# EAGLE design Board_PIC28 (EAGLE 7.6.0)
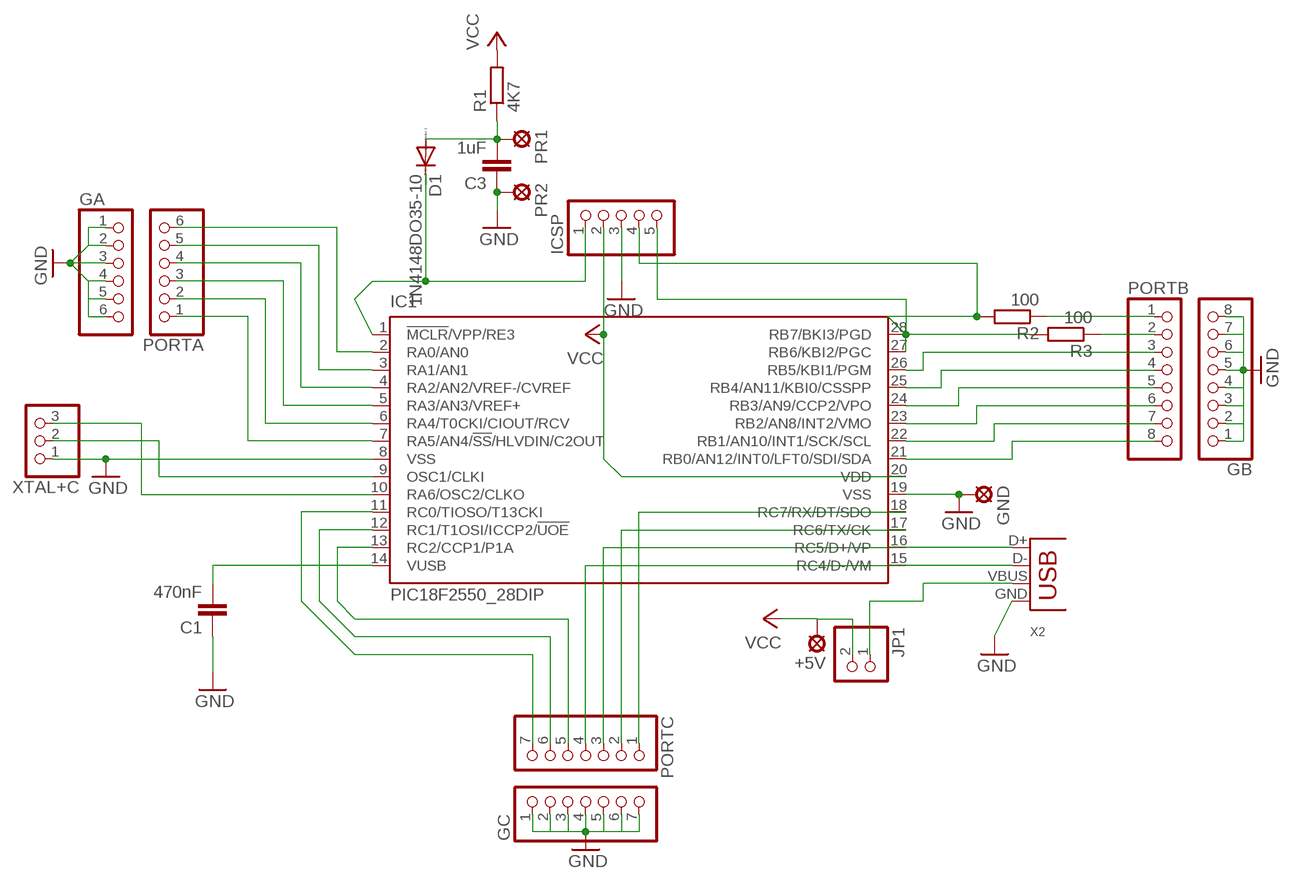
[diagram p0: schematic, sheet 1]

## Parts
+5V  LSP10  [LSP10]
C1  470nF  C5/3.5  [C5B3.5]
C3  1uF  C5/3.5  [C5B3.5]
D1  1N4148DO35-10  [DO35-10]
GA  PINHD-1X6  [1X06]
GB  PINHD-1X8  [1X08]
GC  PINHD-1X7  [1X07]
GND  LSP10  [LSP10]
IC1  PIC18F2550_28DIP  [DIL28-3]
ICSP  PINHD-1X5  [1X05]
JP1  PINHD-1X2  [1X02]
PORTA  PINHD-1X6  [1X06]
PORTB  PINHD-1X8  [1X08]
PORTC  PINHD-1X7  [1X07]
PR1  LSP10  [LSP10]
PR2  LSP10  [LSP10]
R1  4K7  R-EU_0204/7  [0204/7]
R2  100  R-EU_0204/7  [0204/7]
R3  100  R-EU_0204/7  [0204/7]
X2  USB-B-H  [USB-B-H]
XTAL+C  PINHD-1X3  [1X03]

## Nets
GND: C1.1 C3.1 GA.1 GA.2 GA.3 GA.4 GA.5 GA.6 GB.1 GB.2 GB.3 GB.4 GB.5 GB.6 GB.7 GB.8 GC.1 GC.2 GC.3 GC.4 GC.5 GC.6 GC.7 GND.MP IC1.8(VSS) IC1.19(VSS) ICSP.3 PR2.MP X2.GND XTAL+C.1
N$1: C3.2 D1.A PR1.MP R1.1
N$2: IC1.2(RA0/AN0) PORTA.6
N$3: IC1.28(RB7/BKI3/PGD) ICSP.4 R2.2
N$4: IC1.27(RB6/KBI2/PGC) ICSP.5 R3.2
N$5: IC1.26(RB5/KBI1/PGM) PORTB.3
N$6: IC1.25(RB4/AN11/KBI0/CSSPP) PORTB.4
N$7: IC1.24(RB3/AN9/CCP2/VPO) PORTB.5
N$8: IC1.23(RB2/AN8/INT2/VMO) PORTB.6
N$9: IC1.22(RB1/AN10/INT1/SCK/SCL) PORTB.7
N$10: IC1.21(RB0/AN12/INT0/LFT0/SDI/SDA) PORTB.8
N$11: IC1.16(RC5/D+/VP) PORTC.3 X2.D+
N$12: IC1.15(RC4/D-/VM) PORTC.4 X2.D-
N$13: IC1.13(RC2/CCP1/P1A) PORTC.5
N$14: IC1.12(RC1/T1OSI/ICCP2/!UOE) PORTC.6
N$15: IC1.11(RC0/TIOSO/T13CKI) PORTC.7
N$16: IC1.10(RA6/OSC2/CLKO) XTAL+C.3
N$17: IC1.9(OSC1/CLKI) XTAL+C.2
N$18: D1.C IC1.1(!MCLR!/VPP/RE3) ICSP.1
N$19: IC1.3(RA1/AN1) PORTA.5
N$20: IC1.4(RA2/AN2/VREF-/CVREF) PORTA.4
N$21: IC1.5(RA3/AN3/VREF+) PORTA.3
N$22: IC1.6(RA4/T0CKI/CIOUT/RCV) PORTA.2
N$23: IC1.7(RA5/AN4/!SS!/HLVDIN/C2OUT) PORTA.1
N$24: PORTB.1 R2.1
N$25: PORTB.2 R3.1
N$26: C1.2 IC1.14(VUSB)
N$27: JP1.1 X2.VBUS
N$29: IC1.17(RC6/TX/CK) PORTC.2
N$30: IC1.18(RC7/RX/DT/SDO) PORTC.1
VCC: +5V.MP IC1.20(VDD) ICSP.2 JP1.2 R1.2

## Library data of the parts
+5V GND PR1 PR2 = solpad:LSP10: SOLDER PAD drill 1.0 mm, distributor Buerklin, 12H555
C1 C3 = capacitor-wima:C: CAPACITOR naming: grid - package width
D1 = diode:1N4148: DIODE high speed (Philips)
GA PORTA = pinhead:PINHD-1X6: PIN HEADER
GB PORTB = pinhead:PINHD-1X8: PIN HEADER
GC PORTC = pinhead:PINHD-1X7: PIN HEADER
IC1 = microchip:PIC18F2*_28: USB Microcontrollers with nanoWatt Technology High-Performance, Enhanced Flash, 28/40/44-Pin, Source: http://ww1.microchip.com/downloads/en/devicedoc/39632c.pdf; MF: MICROCHIP; MPN: PIC18F2550-I/SP; OC_FARNELL: 1523822; OC_NEWARK: 80K6054
ICSP = pinhead:PINHD-1X5: PIN HEADER
JP1 = pinhead:PINHD-1X2: PIN HEADER
R1-R3 = resistor:R-EU_: RESISTOR, European symbol
X2 = con-usb-3:USB: USB Connectors
XTAL+C = pinhead:PINHD-1X3: PIN HEADER

## Board
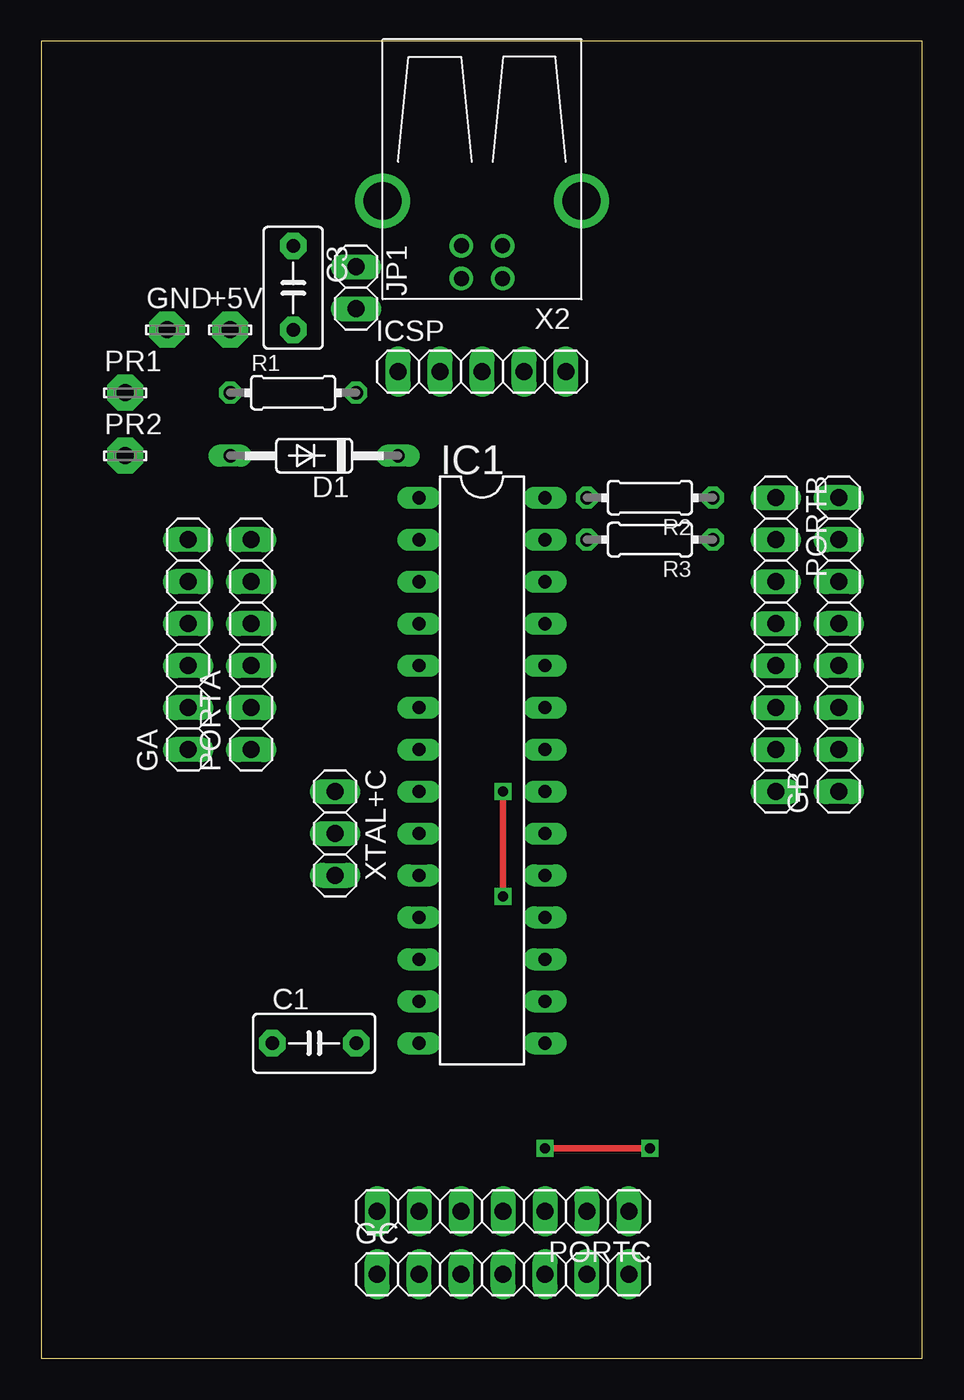
[diagram p1: board, top side]
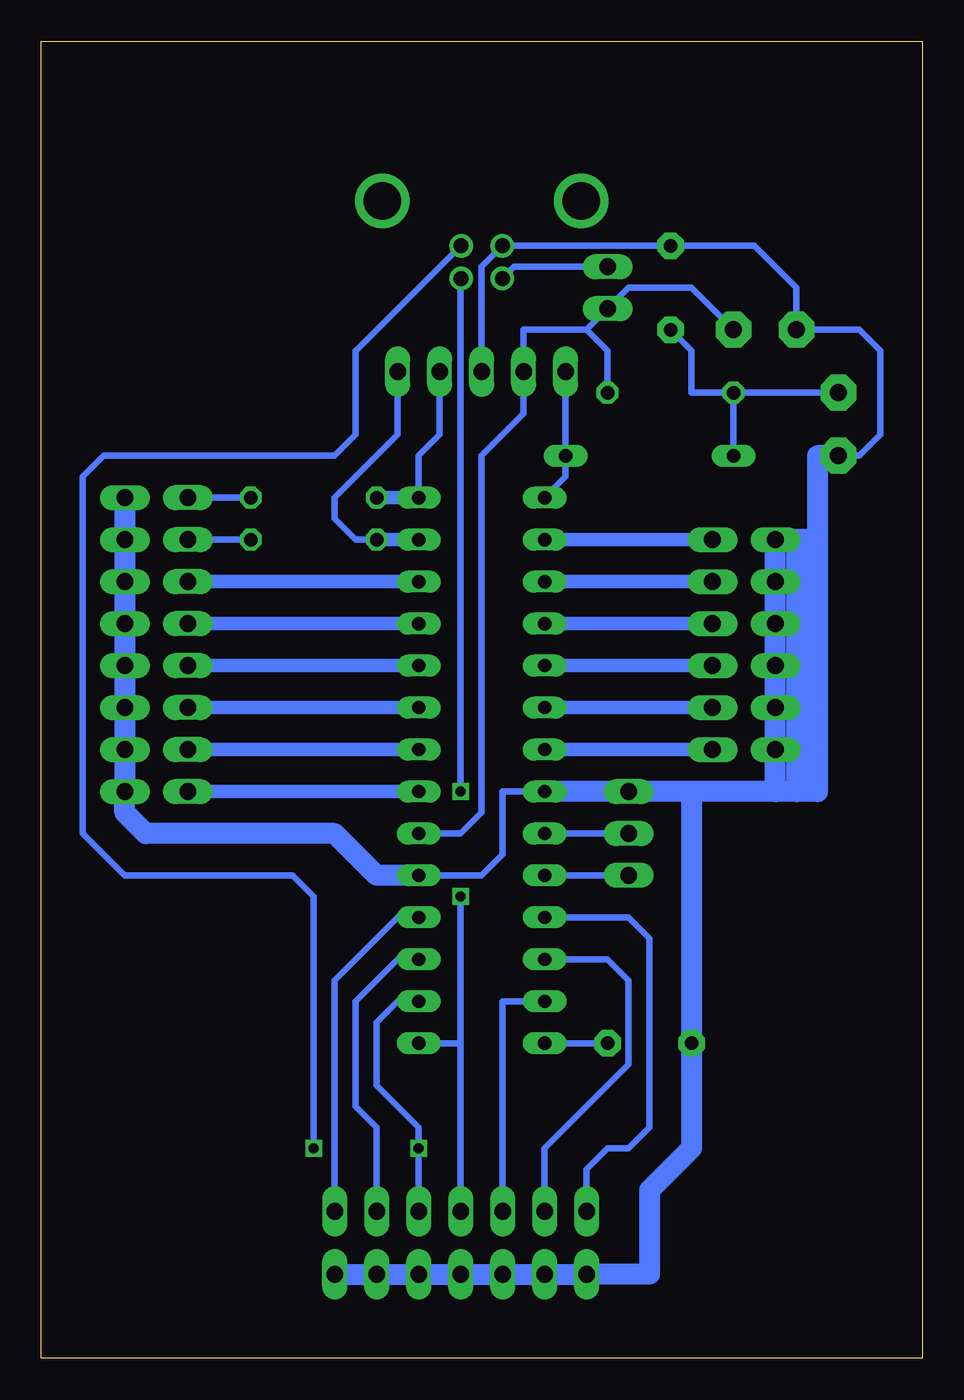
[diagram p2: board, bottom side, seen from below]

Size 53.32 x 79.68 mm. Coordinates in mm from the lower left corner, seen from the top.
Outline: 0,0 53.32,0 53.32,79.68 0,79.68 0,0
Copper layers (1*16): Top 0.035mm / dielectric 1.5mm / Bottom 0.035mm
Design rules "default": minimum track width 10mil, minimum drill 24mil, track to track 8mil, track to pad 8mil, pad to pad 8mil, via to via 8mil, smd to smd 8mil, copper to edge 40mil, drill to drill 8mil, minimum pad ring 10mil, minimum via ring 8mil, stop-mask expansion 4mil, vias tented up to drill 0mil, thermal gap 10mil

### Footprints (pad centres in the part's own frame; a part is rotated, then mirrored left to right if it is on the bottom)
LSP10 = drill 1.016 pad 2.159 octagon: MP 0,0
C5B3.5 = drill 0.813 pad 1.6 octagon: 1 -2.54,0; 2 2.54,0
DO35-10 = drill 0.813 long: A 5.08,0; C -5.08,0
1X06 = drill 1.016 long: 1 -6.35,0; 2 -3.81,0; 3 -1.27,0; 4 1.27,0; 5 3.81,0; 6 6.35,0
1X08 = drill 1.016 long: 1 -8.89,0; 2 -6.35,0; 3 -3.81,0; 4 -1.27,0; 5 1.27,0; 6 3.81,0; 7 6.35,0; 8 8.89,0
1X07 = drill 1.016 long: 1 -7.62,0; 2 -5.08,0; 3 -2.54,0; 4 0,0; 5 2.54,0; 6 5.08,0; 7 7.62,0
DIL28-3 = drill 0.813 long: 1 -16.51,-3.81; 2 -13.97,-3.81; 3 -11.43,-3.81; 4 -8.89,-3.81; 5 -6.35,-3.81; 6 -3.81,-3.81; 7 -1.27,-3.81; 8 1.27,-3.81; 9 3.81,-3.81; 10 6.35,-3.81; 11 8.89,-3.81; 12 11.43,-3.81; 13 13.97,-3.81; 14 16.51,-3.81; 15 16.51,3.81; 16 13.97,3.81; 17 11.43,3.81; 18 8.89,3.81; 19 6.35,3.81; 20 3.81,3.81; 21 1.27,3.81; 22 -1.27,3.81; 23 -3.81,3.81; 24 -6.35,3.81; 25 -8.89,3.81; 26 -11.43,3.81; 27 -13.97,3.81; 28 -16.51,3.81
1X05 = drill 1.016 long: 1 -5.08,0; 2 -2.54,0; 3 0,0; 4 2.54,0; 5 5.08,0
1X02 = drill 1.016 long: 1 -1.27,0; 2 1.27,0
0204/7 = drill 0.813 octagon: 1 -3.81,0; 2 3.81,0
USB-B-H = drill 0.914: D+ 0,1.25; D- 1.981,1.25; GND 0,-1.25; VBUS 1.981,-1.25 | drill 2.286: P$1 -2.718,-6.02; P$2 -2.718,6.02
1X03 = drill 1.016 long: 1 -2.54,0; 2 0,0; 3 2.54,0

### Placement (x,y rotation side)
+5V  11.43,62.23 0 top
C1  16.51,19.05 0 top
C3  15.24,64.77 270 top
D1  16.51,54.61 180 top
GA  8.89,43.18 90 top
GB  48.26,43.18 90 top
GC  27.94,5.08 0 top
GND  7.62,62.23 0 top
IC1  26.67,35.56 270 top
ICSP  26.67,59.69 0 top
JP1  19.05,64.77 270 top
PORTA  12.7,43.18 90 top
PORTB  44.45,43.18 270 top
PORTC  27.94,8.89 180 top
PR1  5.08,58.42 0 top
PR2  5.08,54.61 0 top
R1  15.24,58.42 0 top
R2  36.83,52.07 180 top
R3  36.83,49.53 180 top
X2  26.67,67.31 270 top
XTAL+C  17.78,31.75 270 top

### Tracks (layer width: path | path; a pad name or v marks a point on that pad's centre or on a via)
GND
  Bottom 0.406: PR2.MP 3.81,54.61 2.54,55.88 2.54,60.96 3.81,62.23 GND.MP 7.62,64.77 10.16,67.31 C3.1 X2.GND 26.67,66.06 ICSP.3 | IC1.19 26.67,29.21 25.4,30.48 25.4,34.29 IC1.8 XTAL+C.1 13.97,34.29
  Bottom 1.27: PR2.MP 6.35,54.61 6.35,49.53 | 6.35,49.53 6.35,34.29 7.62,34.29 | 7.62,34.29 8.89,34.29 | 8.89,34.29 GA.1 GA.2 GA.3 GA.4 GA.5 GA.6 | 6.35,49.53 GA.6 | GA.6 7.62,49.53 7.62,34.29 | 8.89,34.29 13.97,34.29 | 13.97,34.29 IC1.8 | 13.97,34.29 C1.1 13.97,12.7 16.51,10.16 16.51,5.08 GC.1 GC.2 GC.3 GC.4 GC.5 GC.6 GC.7 | GB.8 GB.7 GB.6 GB.5 GB.4 GB.3 GB.2 GB.1 48.26,33.02 46.99,31.75 35.56,31.75 33.02,29.21 IC1.19
N$1
  Bottom 0.406: R1.1 D1.A | PR1.MP R1.1 | R1.1 13.97,58.42 13.97,60.96 C3.2
N$2
  Bottom 0.813: PORTA.6 IC1.2
N$3
  Bottom 0.406: ICSP.4 29.21,55.88 30.48,54.61 IC1.28
  Bottom 0.813: IC1.28 R2.2
N$4
  Bottom 0.406: ICSP.5 31.75,55.88 35.56,52.07 35.56,50.8 34.29,49.53 R3.2
  Bottom 0.813: IC1.27 R3.2
N$5
  Bottom 0.813: IC1.26 PORTB.3
N$6
  Bottom 0.813: IC1.25 PORTB.4
N$7
  Bottom 0.813: IC1.24 PORTB.5
N$8
  Bottom 0.813: IC1.23 PORTB.6
N$9
  Bottom 0.813: IC1.22 PORTB.7
N$10
  Bottom 0.813: IC1.21 PORTB.8
N$11  (via drill 0.6)
  Top 0.406: v30.48,12.7 v36.83,12.7
  Bottom 0.406: PORTC.3 v30.48,12.7 30.48,13.97 33.02,16.51 33.02,20.32 31.75,21.59 IC1.16 | X2.D+ 34.27,60.96 34.29,60.96 34.29,55.88 35.56,54.61 49.53,54.61 50.8,53.34 50.8,31.75 48.26,29.21 38.1,29.21 36.83,27.94 v36.83,12.7
N$12  (via drill 0.6)
  Top 0.406: v27.94,34.29 v27.94,27.94
  Bottom 0.406: PORTC.4 27.94,19.05 | 27.94,19.05 IC1.15 | X2.D- 27.94,65.31 v27.94,34.29 | 27.94,19.05 v27.94,27.94
N$13
  Bottom 0.406: PORTC.5 25.4,21.59 IC1.13
N$14
  Bottom 0.406: PORTC.6 22.86,12.7 17.78,17.78 17.78,22.86 19.05,24.13 IC1.12
N$15
  Bottom 0.406: IC1.11 17.78,26.67 16.51,25.4 16.51,13.97 17.78,12.7 19.05,12.7 20.32,11.43 PORTC.7
N$16
  Bottom 0.406: IC1.10 XTAL+C.3
N$17
  Bottom 0.406: IC1.9 XTAL+C.2
N$18
  Bottom 0.406: IC1.1 21.59,53.34 D1.C ICSP.1
N$19
  Bottom 0.813: PORTA.5 IC1.3
N$20
  Bottom 0.813: PORTA.4 IC1.4
N$21
  Bottom 0.813: PORTA.3 IC1.5
N$22
  Bottom 0.813: PORTA.2 IC1.6
N$23
  Bottom 0.813: PORTA.1 IC1.7
N$24
  Bottom 0.406: R2.1 PORTB.1
N$25
  Bottom 0.406: R3.1 PORTB.2
N$26
  Bottom 0.406: C1.2 IC1.14
N$27
  Bottom 0.406: X2.VBUS 24.71,66.04 JP1.1
N$29
  Bottom 0.406: PORTC.2 33.02,13.97 34.29,15.24 34.29,21.59 31.75,24.13 IC1.17
N$30
  Bottom 0.406: PORTC.1 35.56,22.86 31.75,26.67 IC1.18
VCC
  Bottom 0.406: R1.2 19.05,60.96 20.32,62.23 | 20.32,62.23 24.13,62.23 ICSP.2 24.13,57.15 26.67,54.61 26.67,33.02 27.94,31.75 IC1.20 | +5V.MP 13.97,64.77 17.78,64.77 JP1.2 20.32,62.23